# EAGLE design czujnik_schemat (EAGLE 8.1.1)
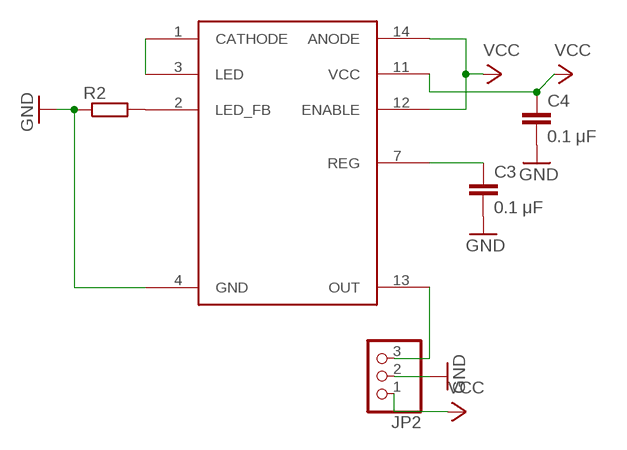
[diagram p0: schematic, sheet 1]

## Parts
C3  0.1 μF  C-EU025-025X050  [C025-025X050]
C4  0.1 μF  C-EU025-025X050  [C025-025X050]
JP2  PINHD-1X3  [1X03]
R2  R-EU_0204/5  [0204/5]
U$2  GP2Y0D810Z0F  [LP16PIN]

## Nets
GND: C3.2 C4.2 JP2.2 R2.1 U$2.4(GND)
N$5: R2.2 U$2.2(LED_FB)
N$6: C3.1 U$2.7(REG)
N$7: U$2.1(CATHODE) U$2.3(LED)
N$8: JP2.3 U$2.13(OUT)
VCC: C4.1 JP2.1 U$2.11(VCC) U$2.12(ENABLE) U$2.14(ANODE)

## Library data of the parts
C3 C4 = rcl:C-EU: CAPACITOR, European symbol
JP2 = pinhead:PINHD-1X3: PIN HEADER
R2 = rcl:R-EU_: RESISTOR, European symbol
U$2 = SharpGP2Y0D810Z0F:GP2Y0D810Z0F: Sharpt GP2Y0D810Z0F 10cm IR proximity sensor

## Board
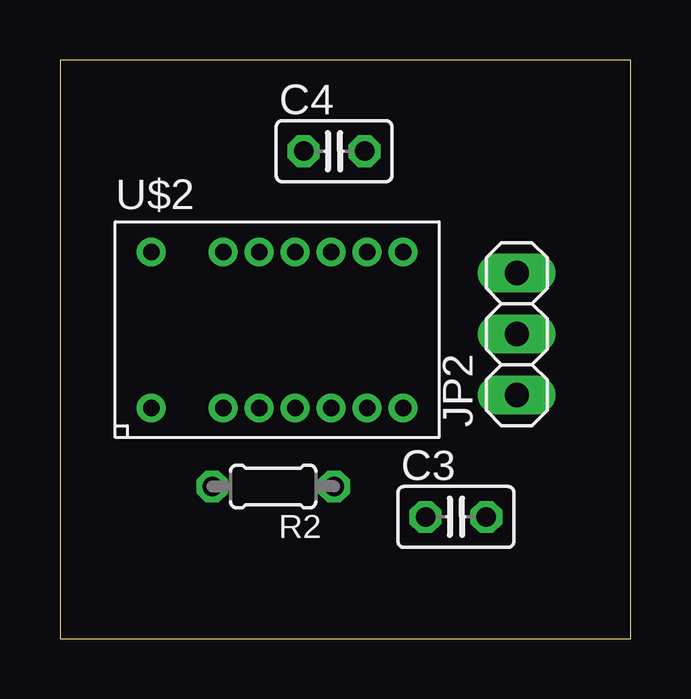
[diagram p1: board, top side]
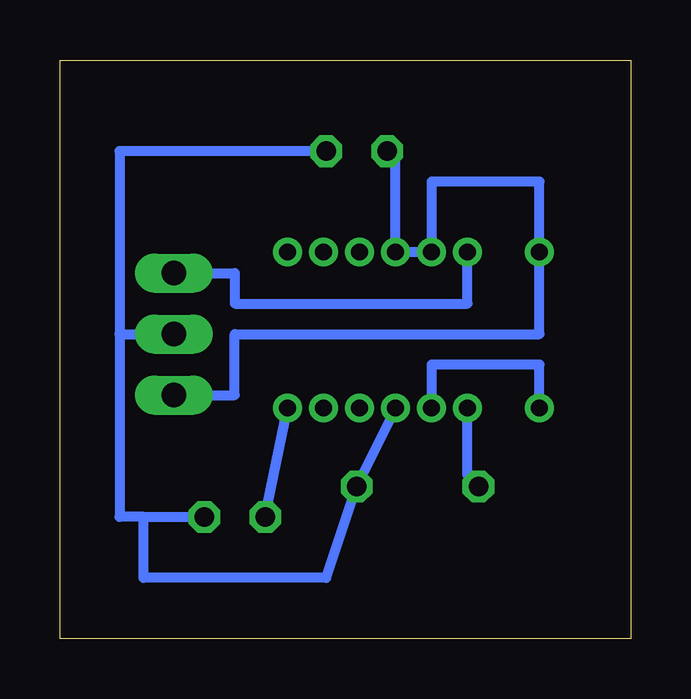
[diagram p2: board, bottom side, seen from below]

Size 23.8 x 24.12 mm. Coordinates in mm from the lower left corner, seen from the top.
Outline: 0,0 23.8,0 23.8,24.12 0,24.12 0,0
Copper layers (1*16): Top 0.035mm / dielectric 1.5mm / Bottom 0.035mm
Design rules "default *": minimum track width 10mil, minimum drill 24mil, track to track 8mil, track to pad 8mil, pad to pad 8mil, via to via 8mil, smd to smd 8mil, copper to edge 40mil, drill to drill 8mil, minimum pad ring 10mil, minimum via ring 8mil, stop-mask expansion 4mil, vias tented up to drill 0mil, thermal gap 10mil

### Footprints (pad centres in the part's own frame; a part is rotated, then mirrored left to right if it is on the bottom)
C025-025X050 = drill 0.813 octagon: 1 -1.27,0; 2 1.27,0
1X03 = drill 1.016 long: 1 -2.54,0; 2 0,0; 3 2.54,0
0204/5 = drill 0.813 octagon: 1 -2.54,0; 2 2.54,0
LP16PIN = drill 0.7: 1 0,0.73; 2 3,0.73; 3 4.5,0.73; 4 6,0.73; 5 7.5,0.73; 6 9,0.73; 7 10.5,0.73; 8 10.5,7.23; 9 9,7.23; 10 7.5,7.23; 11 6,7.23; 12 4.5,7.23; 13 3,7.23; 14 0,7.23

### Placement (x,y rotation side)
C3  16.51,5.08 0 top
C4  11.43,20.32 0 top
JP2  19.05,12.7 90 top
R2  8.89,6.35 180 top
U$2  3.81,8.89 0 top

### Tracks (layer width: path | path; a pad name or v marks a point on that pad's centre or on a via)
GND
  Bottom 0.406: 20.32,5.08 C3.2 | 20.32,5.08 21.31,5.08 21.31,12.7 | 21.31,12.7 JP2.2 | U$2.4 R2.1 12.7,2.54 20.32,2.54 20.32,5.08 | 21.31,12.7 21.31,20.32 C4.2
N$5
  Bottom 0.406: R2.2 6.81,6.81 U$2.2
N$6
  Bottom 0.406: C3.1 U$2.7
N$7
  Bottom 0.406: U$2.1 3.81,11.43 8.31,11.43 U$2.3
N$8
  Bottom 0.406: JP2.3 16.51,15.24 16.51,13.97 6.81,13.97 U$2.13
VCC
  Bottom 0.406: C4.1 9.81,20.32 U$2.11 U$2.12 8.31,19.05 3.81,19.05 U$2.14 3.81,12.7 16.51,12.7 16.51,10.16 JP2.1